# Altium schematic sheet LaunchPad Connectors.SchDoc
size A2
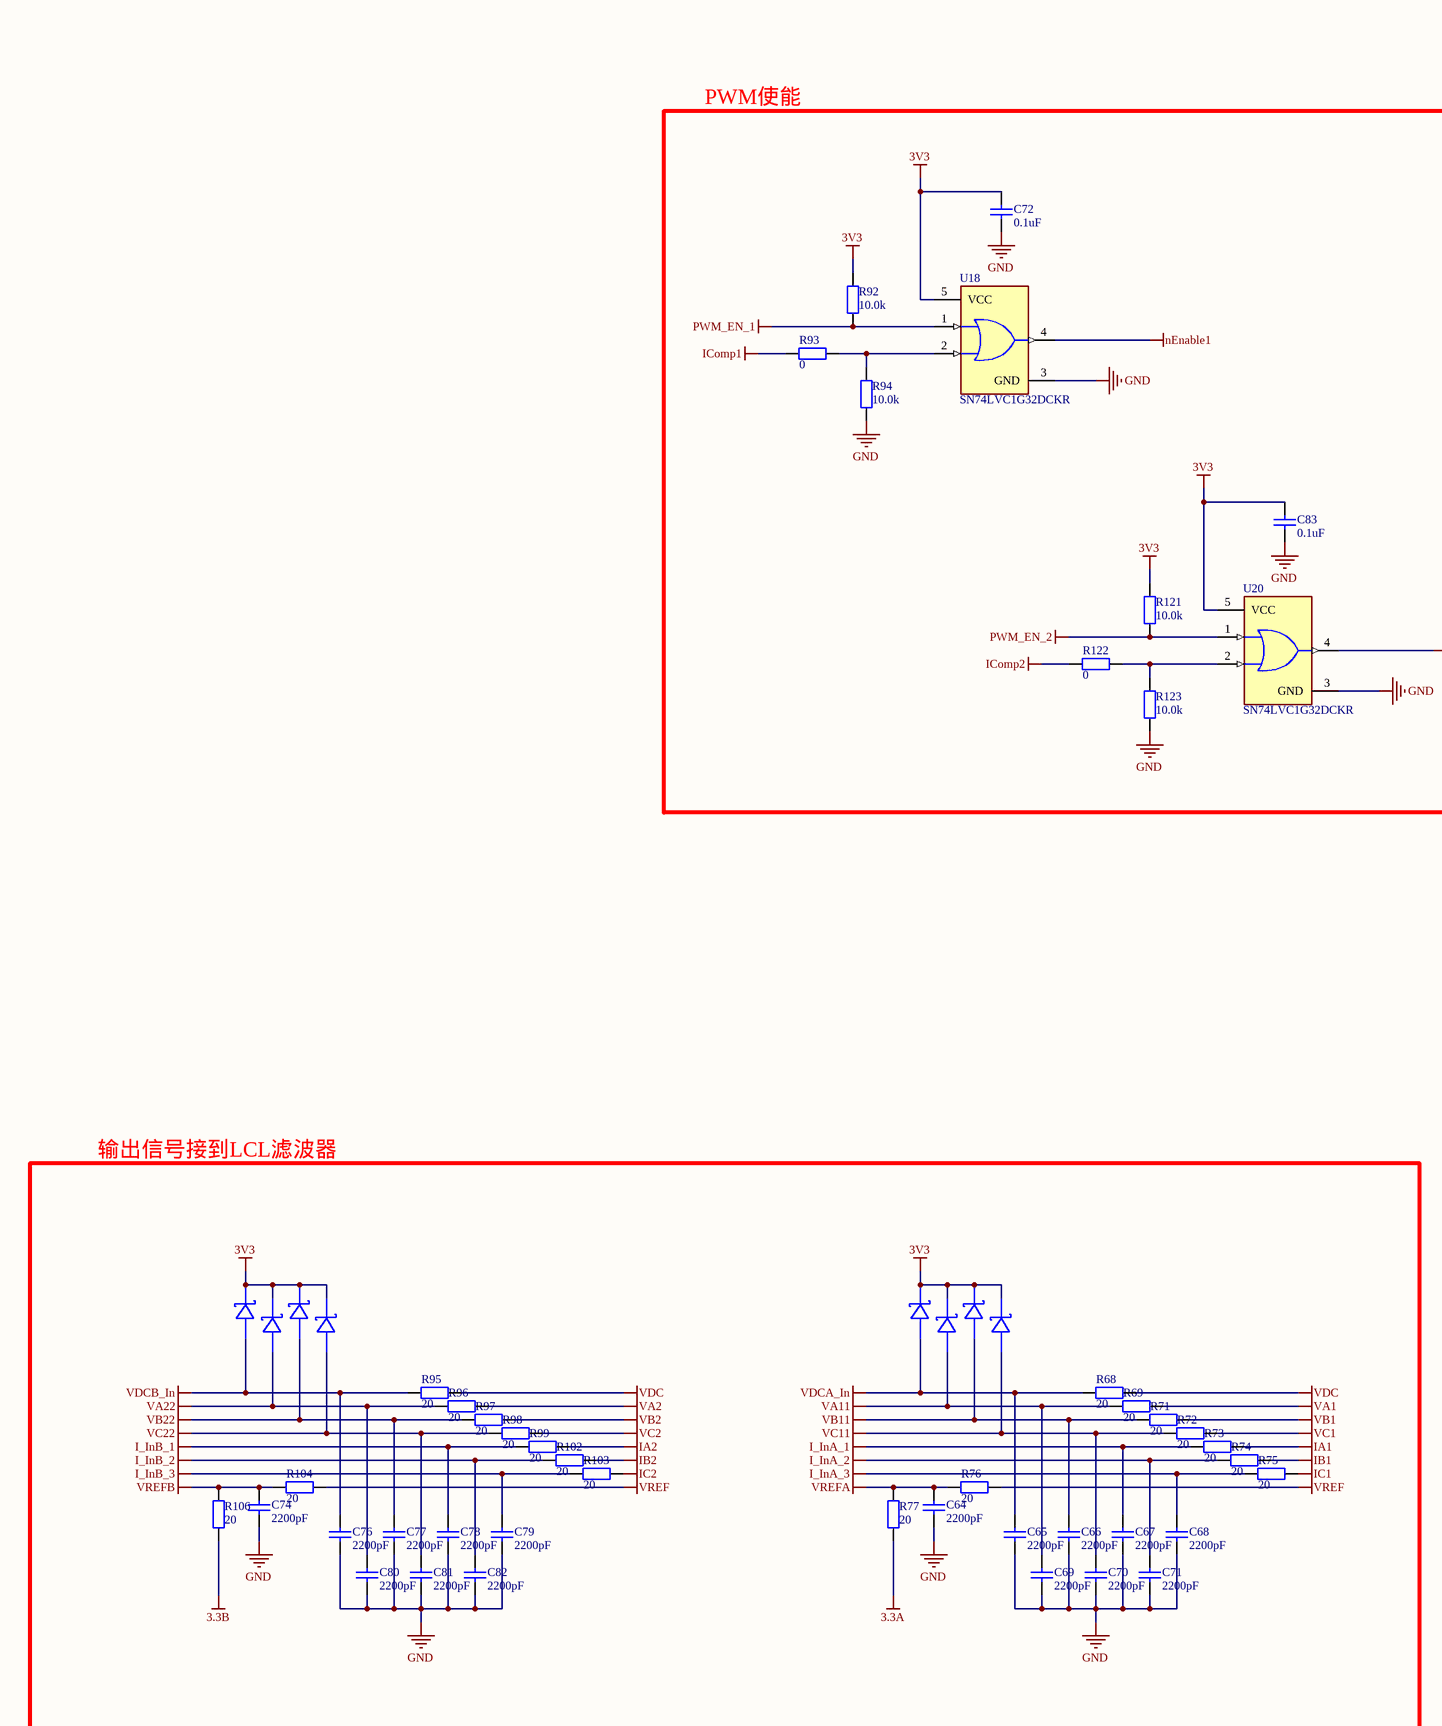
[diagram p0: LaunchPad Connectors.SchDoc, left]
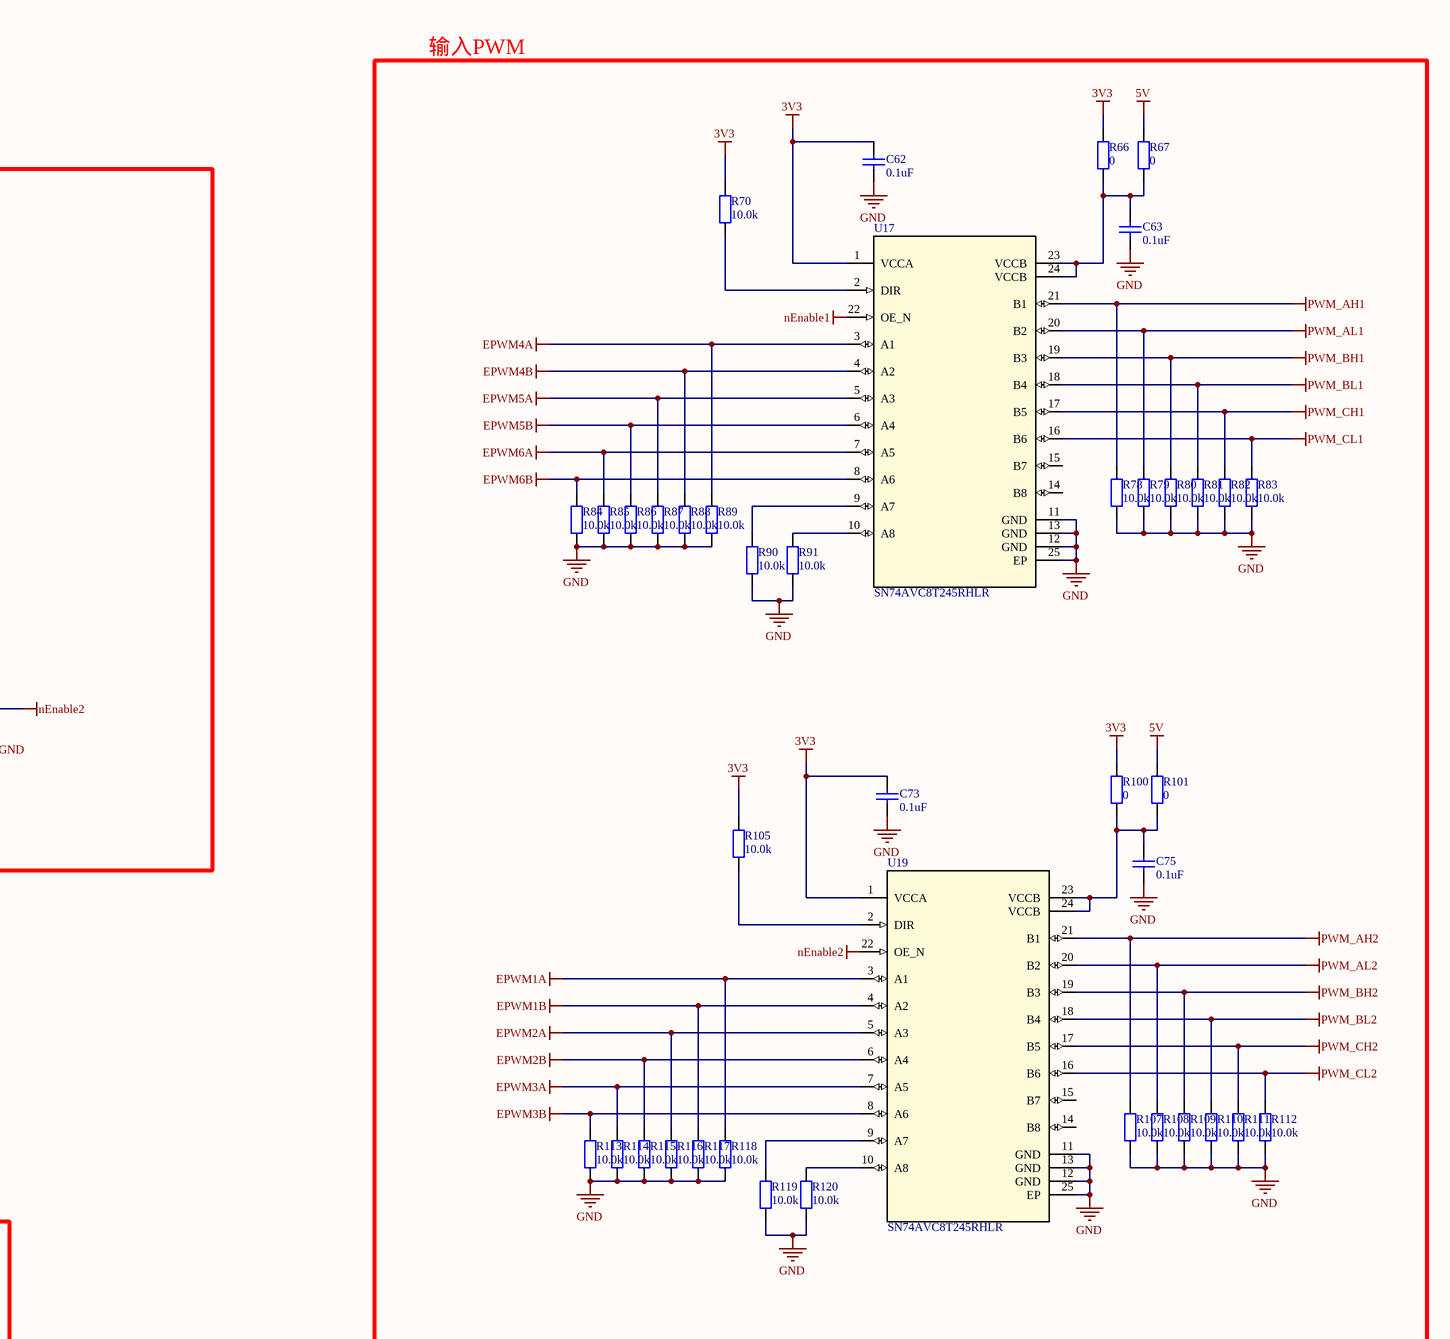
[diagram p1: LaunchPad Connectors.SchDoc, right]

## Parts
C62  0.1uF  [CAPC1608X06N]
C63  0.1uF  [CAPC1608X06N]
C64  2200pF  [CAPC1608X06N]
C65  2200pF  [CAPC1608X06N]
C66  2200pF  [CAPC1608X06N]
C67  2200pF  [CAPC1608X06N]
C68  2200pF  [CAPC1608X06N]
C69  2200pF  [CAPC1608X06N]
C70  2200pF  [CAPC1608X06N]
C71  2200pF  [CAPC1608X06N]
C72  0.1uF  [CAPC1608X06N]
C73  0.1uF  [CAPC1608X06N]
C74  2200pF  [CAPC1608X06N]
C75  0.1uF  [CAPC1608X06N]
C76  2200pF  [CAPC1608X06N]
C77  2200pF  [CAPC1608X06N]
C78  2200pF  [CAPC1608X06N]
C79  2200pF  [CAPC1608X06N]
C80  2200pF  [CAPC1608X06N]
C81  2200pF  [CAPC1608X06N]
C82  2200pF  [CAPC1608X06N]
C83  0.1uF  [CAPC1608X06N]
D1  1PS79SB70,115  [SOD-523_L1.2-W0.8-LS1.6-RD]  (value not drawn)
D2  1PS79SB70,115  [SOD-523_L1.2-W0.8-LS1.6-RD]  (value not drawn)
D3  1PS79SB70,115  [SOD-523_L1.2-W0.8-LS1.6-RD]  (value not drawn)
D4  1PS79SB70,115  [SOD-523_L1.2-W0.8-LS1.6-RD]  (value not drawn)
D5  1PS79SB70,115  [SOD-523_L1.2-W0.8-LS1.6-RD]  (value not drawn)
D6  1PS79SB70,115  [SOD-523_L1.2-W0.8-LS1.6-RD]  (value not drawn)
D7  1PS79SB70,115  [SOD-523_L1.2-W0.8-LS1.6-RD]  (value not drawn)
D8  1PS79SB70,115  [SOD-523_L1.2-W0.8-LS1.6-RD]  (value not drawn)
R66  0  [RESC1608X05N]
R67  0  [RESC1608X05N]
R68  20  [RESC1608X05N]
R69  20  [RESC1608X05N]
R70  10.0k  [RESC1608X05N]
R71  20  [RESC1608X05N]
R72  20  [RESC1608X05N]
R73  20  [RESC1608X05N]
R74  20  [RESC1608X05N]
R75  20  [RESC1608X05N]
R76  20  [RESC1608X05N]
R77  20  [RESC1608X05N]
R78  10.0k  [RESC1608X05N]
R79  10.0k  [RESC1608X05N]
R80  10.0k  [RESC1608X05N]
R81  10.0k  [RESC1608X05N]
R82  10.0k  [RESC1608X05N]
R83  10.0k  [RESC1608X05N]
R84  10.0k  [RESC1608X05N]
R85  10.0k  [RESC1608X05N]
R86  10.0k  [RESC1608X05N]
R87  10.0k  [RESC1608X05N]
R88  10.0k  [RESC1608X05N]
R89  10.0k  [RESC1608X05N]
R90  10.0k  [RESC1608X05N]
R91  10.0k  [RESC1608X05N]
R92  10.0k  [RESC1608X05N]
R93  0  [RESC1608X05N]
R94  10.0k  [RESC1608X05N]
R95  20  [RESC1608X05N]
R96  20  [RESC1608X05N]
R97  20  [RESC1608X05N]
R98  20  [RESC1608X05N]
R99  20  [RESC1608X05N]
R100  0  [RESC1608X05N]
R101  0  [RESC1608X05N]
R102  20  [RESC1608X05N]
R103  20  [RESC1608X05N]
R104  20  [RESC1608X05N]
R105  10.0k  [RESC1608X05N]
R106  20  [RESC1608X05N]
R107  10.0k  [RESC1608X05N]
R108  10.0k  [RESC1608X05N]
R109  10.0k  [RESC1608X05N]
R110  10.0k  [RESC1608X05N]
R111  10.0k  [RESC1608X05N]
R112  10.0k  [RESC1608X05N]
R113  10.0k  [RESC1608X05N]
R114  10.0k  [RESC1608X05N]
R115  10.0k  [RESC1608X05N]
R116  10.0k  [RESC1608X05N]
R117  10.0k  [RESC1608X05N]
R118  10.0k  [RESC1608X05N]
R119  10.0k  [RESC1608X05N]
R120  10.0k  [RESC1608X05N]
R121  10.0k  [RESC1608X05N]
R122  0  [RESC1608X05N]
R123  10.0k  [RESC1608X05N]
U17  SN74AVC8T245RHLR  [RHL0024A]
U18  SN74LVC1G32DCKR  [FP-DCK0005A-IPC_A]
U19  SN74AVC8T245RHLR  [RHL0024A]
U20  SN74LVC1G32DCKR  [FP-DCK0005A-IPC_A]

## Nets
3.3A: R77.2
3.3B: R106.2
3V3: C62.1 C72.1 C73.1 C83.1 D1.1(K) D2.1(K) D3.1(K) D4.1(K) D5.1(K) D6.1(K) D7.1(K) D8.1(K) R66.2 R70.1 R92.1 R100.2 R105.1 R121.1 U17.1(VCCA) U18.5(VCC) U19.1(VCCA) U20.5(VCC)
5V: R67.2 R101.2
EPWM1A: R118.2 U19.3(A1)
EPWM1B: R117.2 U19.4(A2)
EPWM2A: R116.1 U19.5(A3)
EPWM2B: R115.2 U19.6(A4)
EPWM3A: R114.2 U19.7(A5)
EPWM3B: R113.2 U19.8(A6)
EPWM4A: R89.2 U17.3(A1)
EPWM4B: R88.2 U17.4(A2)
EPWM5A: R87.1 U17.5(A3)
EPWM5B: R86.2 U17.6(A4)
EPWM6A: R85.2 U17.7(A5)
EPWM6B: R84.2 U17.8(A6)
GND: C62.2 C63.2 C64.2 C65.2 C66.2 C67.2 C68.2 C69.2 C70.2 C71.2 C72.2 C73.2 C74.2 C75.2 C76.2 C77.2 C78.2 C79.2 C80.2 C81.2 C82.2 C83.2 R78.2 R79.2 R80.2 R81.2 R82.2 R83.2 R84.1 R85.1 R86.1 R87.2 R88.1 R89.1 R90.2 R91.2 R94.1 R107.2 R108.2 R109.2 R110.2 R111.2 R112.2 R113.1 R114.1 R115.1 R116.2 R117.1 R118.1 R119.2 R120.2 R123.1 U17.11(GND) U17.12(GND) U17.13(GND) U17.25(EP) U18.3(GND) U19.11(GND) U19.12(GND) U19.13(GND) U19.25(EP) U20.3(GND)
I_InA_1: C67.1 R73.2
I_InA_2: C71.1 R74.2
I_InA_3: C68.1 R75.2
I_InB_1: C78.1 R99.2
I_InB_2: C82.1 R102.2
I_InB_3: C79.1 R103.2
IA1: R73.1
IA2: R99.1
IB1: R74.1
IB2: R102.1
IC1: R75.1
IC2: R103.1
IComp1: R93.1
IComp2: R122.1
nEnable1: U17.22(OE_N) U18.4(Y)
nEnable2: U19.22(OE_N) U20.4(Y)
PWM_AH1: R78.1 U17.21(B1)
PWM_AH2: R107.1 U19.21(B1)
PWM_AL1: R79.1 U17.20(B2)
PWM_AL2: R108.1 U19.20(B2)
PWM_BH1: R80.1 U17.19(B3)
PWM_BH2: R109.1 U19.19(B3)
PWM_BL1: R81.1 U17.18(B4)
PWM_BL2: R110.1 U19.18(B4)
PWM_CH1: R82.1 U17.17(B5)
PWM_CH2: R111.1 U19.17(B5)
PWM_CL1: R83.1 U17.16(B6)
PWM_CL2: R112.1 U19.16(B6)
PWM_EN_1: R92.2 U18.1(A)
PWM_EN_2: R121.2 U20.1(A)
VA1: R69.1
VA2: R96.1
VA11: C69.1 D3.2(A) R69.2
VA22: C80.1 D7.2(A) R96.2
VB1: R71.1
VB2: R97.1
VB11: C66.1 D2.2(A) R71.2
VB22: C77.1 D6.2(A) R97.2
VC1: R72.1
VC2: R98.1
VC11: C70.1 D4.2(A) R72.2
VC22: C81.1 D8.2(A) R98.2
VDC: R68.1 R95.1
VDCA_In: C65.1 D1.2(A) R68.2
VDCB_In: C76.1 D5.2(A) R95.2
VREF: R76.1 R104.1
VREFA: C64.1 R76.2 R77.1
VREFB: C74.1 R104.2 R106.1
NetC63_1: C63.1 R66.1 R67.1 U17.23(VCCB) U17.24(VCCB)
NetC75_1: C75.1 R100.1 R101.1 U19.23(VCCB) U19.24(VCCB)
NetR70_2: R70.2 U17.2(DIR)
NetR90_1: R90.1 U17.9(A7)
NetR91_1: R91.1 U17.10(A8)
NetR93_2: R93.2 R94.2 U18.2(B)
NetR105_2: R105.2 U19.2(DIR)
NetR119_1: R119.1 U19.9(A7)
NetR120_1: R120.1 U19.10(A8)
NetR122_2: R122.2 R123.2 U20.2(B)

Not connected (* = marked no-connect by the designer): U17 14(B8) 15(B7); U19 14(B8) 15(B7)

## Notes on the sheet
- 输入PWM
- PWM使能
- 输出信号接到LCL滤波器

## Library data of the parts
C62-C83 = Cap: Capacitor; Published: 8-Jun-2000; LatestRevisionDate: 17-Jul-2002; LatestRevisionNote: Re-released for DXP Platform.; PackageReference: RAD-0.3; Publisher: Altium Limited; PackageDescription: Radial Cap, Thru-Hole; 2 Leads; 0.3 in Pin Spacing
  C62 C63 C72 C73 C75 C83: Value: 0.1uF
  C64-C71 C74 C76-C82: Value: 2200pF
D1-D8 = 1PS79SB70,115: Manufacturer: Nexperia(安世); Add into BOM: yes; Forward Voltage (Vf@If): 1V@15mA; Reverse Voltage (Vr): 70V; Average Rectified Current (Io): 70mA; Reverse Leakage Current (Ir): 10uA@70V; Symbol: 1PS79SB70,115; Device: 1PS79SB70,115; Supplier: LCSC; Manufacturer Part: 1PS79SB70,115; Supplier Part: C179321; JLCPCB Part Class: Extended Part; LCSC Part Name: 电压:70V 电流:70mA; Supplier Footprint: SOD-523; Datasheet: https://atta.szlcsc.com/upload/public/pdf/source/20180622/C194653_3DF408F362D9AF6B8137F44B9C19B985.pdf; Convert to PCB: yes
R66 R67 R100 R101 = Res: Resistor 0402; Value: K; Published: 8-Jun-2000; LatestRevisionDate: 17-Jul-2002; LatestRevisionNote: Re-released for DXP Platform.; PackageReference: AXIAL-0.4; Publisher: Altium Limited; PackageDescription: Axial Device, Thru-Hole; 2 Leads; 0.4 in Pin Spacing
R68-R99 R102-R123 = 0603 100KΩ (1003) 1%_4: 贴片电阻; Value: 1MΩ(1%); ComponentLink1Description: 供应商链接; ComponentLink1URL: http://www.szlcsc.com/product/details_26546.html; Package: 0603; Supplier: LC; SuppliersPartNumber: C25803
U17 U19 = SN74AVC8T245RHLR: No Description Available; Mfr_Name: Texas Instruments; CompType: IC; Type: DEV; RefDes: RefDes; Copyright: Copyright (C) 2024 Ultra Librarian. All rights reserved.; Manufacturer_Part_Number: SN74AVC8T245RHLR; PartNumber: SN74AVC8T245RHL; PackageReference: RHL0024A; MountType: SMT; RoHS: Y; Manufacturer: Texas Instruments
U18 U20 = CMP-0859-00376-4: IC GATE OR 1CH 2-INP SC70-5; Turn-On Delay Time: 4.5ns; Schmitt Trigger Input: No; Number of Bits: 1; High Level Output Current: -32mA; Max Supply Voltage: 5.5V; Propagation Delay: 4ns; Max Output Current: 32mA; Min Supply Voltage: 1.65V; Number of Input Lines: 2; Quiescent Current: 10uA; Case/Package: SC; Weight: 8.8E-05oz; Logic Function: OR; Package Quantity: 1; Packaging: Tape and Reel; Mount: Surface Mount; Max Operating Temperature: 125°C; Output Current: 32mA; Length: 2mm; Contact Plating: Gold; Number of Output Lines: 1; Height: 0.9mm; Number of Pins: 5; Width: 1.25mm; REACH SVHC: No SVHC; Number of Circuits: 1; Radiation Hardening: No; Number of Elements: 1; Low Level Output Current: 32mA; Number of Outputs: 1; Min Operating Temperature: -40°C; Number of Inputs: 2; Lead Free: Lead Free; Termination: SMD/SMT; Number of Gates: 1